# Altium schematic sheet Heltec_ESP32.SchDoc
size A
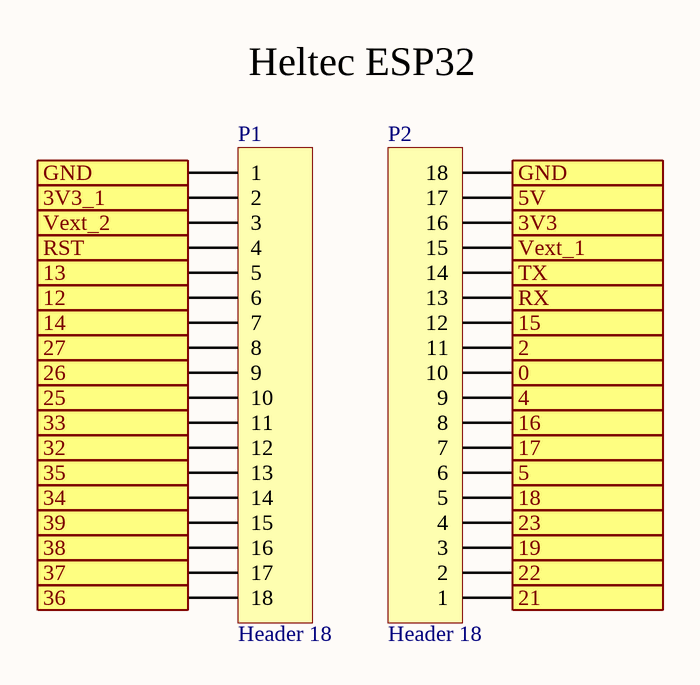
[diagram p0: Heltec_ESP32.SchDoc]

## Parts
P1  Header 18  [HDR1X18]
P2  Header 18  [HDR1X18]

## Ports
0, 2, 3V3, 3V3_1, 4, 5, 5V, 12, 13, 14, 15, 16, 17, 18, 19, 21, 22, 23, 25, 26, 27, 32, 33, 34, 35, 36, 37, 38, 39, GND, RST, RX, TX, Vext_1, Vext_2

## Nets
0: P2.10 ; port 0
2: P2.11 ; port 2
3V3: P2.16 ; port 3V3
3V3_1: P1.2 ; port 3V3_1
4: P2.9 ; port 4
5: P2.6 ; port 5
5V: P2.17 ; port 5V
12: P1.6 ; port 12
13: P1.5 ; port 13
14: P1.7 ; port 14
15: P2.12 ; port 15
16: P2.8 ; port 16
17: P2.7 ; port 17
18: P2.5 ; port 18
19: P2.3 ; port 19
21: P2.1 ; port 21
22: P2.2 ; port 22
23: P2.4 ; port 23
25: P1.10 ; port 25
26: P1.9 ; port 26
27: P1.8 ; port 27
32: P1.12 ; port 32
33: P1.11 ; port 33
34: P1.14 ; port 34
35: P1.13 ; port 35
36: P1.18 ; port 36
37: P1.17 ; port 37
38: P1.16 ; port 38
39: P1.15 ; port 39
GND: P1.1 P2.18 ; port GND
RST: P1.4 ; port RST
RX: P2.13 ; port RX
TX: P2.14 ; port TX
Vext_1: P2.15 ; port Vext_1
Vext_2: P1.3 ; port Vext_2

## Notes on the sheet
- Heltec ESP32

## Library data of the parts
P1 P2 = Header 18: Header, 18-Pin; LatestRevisionDate: 17-Jul-2002; LatestRevisionNote: Re-released for DXP Platform.; Publisher: Altium Limited